# EAGLE schematic Adafruit Feather M0 RFMxx copy headers (EAGLE 9.4.1)
COMPANY: ADAFRUIT INDUSTRIES; DRAWN: KTOWN; REV: B
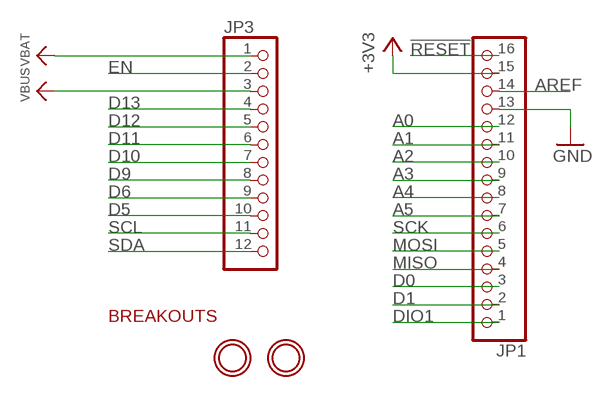
[diagram p0: schematic, sheet 1]

## Parts
JP1  HEADER-1X16ROUND  [1X16_ROUND]
JP3  HEADER-1X12  [1X12_ROUND]
U$1  MOUNTINGHOLE2.5  [MOUNTINGHOLE_2.5_PLATED]
U$2  MOUNTINGHOLE2.5  [MOUNTINGHOLE_2.5_PLATED]

## Nets
!RESET: JP1.16
+3V3: JP1.15
A0: JP1.12
A1: JP1.11
A2: JP1.10
A3: JP1.9
A4: JP1.8
A5: JP1.7
AREF: JP1.14
D0: JP1.3
D1: JP1.2
D5: JP3.10
D6: JP3.9
D9: JP3.8
D10: JP3.7
D11: JP3.6
D12: JP3.5
D13: JP3.4
DIO1: JP1.1
EN: JP3.2
GND: JP1.13
MISO: JP1.4
MOSI: JP1.5
SCK: JP1.6
SCL: JP3.11
SDA: JP3.12
VBAT: JP3.1
VBUS: JP3.3

## Notes on the sheet
- BREAKOUTS

## Library data of the parts
JP1 = microbuilder:HEADER-1X16: PIN HEADER
JP3 = microbuilder:HEADER-1X12
U$1 U$2 = microbuilder:MOUNTINGHOLE: Mounting Hole For #2 screws (0.086"/2.18mm width, 0.094"/2.4mm hole) use 2.5mm